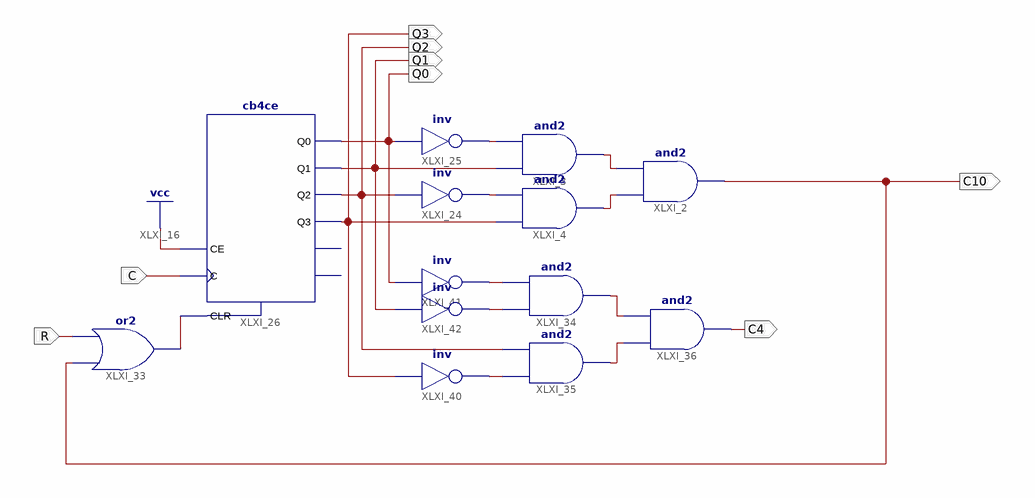
[diagram p0: schematic sheet 1]
// Xilinx ISE schematic uHora.sch (spartan3e) as structural Verilog: 13 symbols, 8 ports
module uHora (
  input  C,
  input  R,
  output Q1,
  output Q2,
  output Q3,
  output Q0,
  output C4,
  output C10
);

  wire XLXN_69, XLXN_70, XLXN_72, XLXN_76, XLXN_77, XLXN_79, XLXN_80, XLXN_82, XLXN_83, XLXN_84;

  and XLXI_2 (C10, XLXN_72, XLXN_70);
  and XLXI_3 (XLXN_70, Q1, XLXN_76);
  and XLXI_4 (XLXN_72, Q3, XLXN_69);
  not XLXI_24 (XLXN_69, Q2);
  not XLXI_25 (XLXN_76, Q0);
  cb4ce XLXI_26 (.C(C), .CE(1'b1), .CLR(XLXN_77), .Q0(Q0), .Q1(Q1), .Q2(Q2), .Q3(Q3));  // open: CEO, TC
  or XLXI_33 (XLXN_77, C10, R);
  and XLXI_34 (XLXN_79, XLXN_84, XLXN_83);
  and XLXI_35 (XLXN_80, XLXN_82, Q2);
  and XLXI_36 (C4, XLXN_80, XLXN_79);
  not XLXI_40 (XLXN_82, Q3);
  not XLXI_41 (XLXN_83, Q0);
  not XLXI_42 (XLXN_84, Q1);
endmodule
